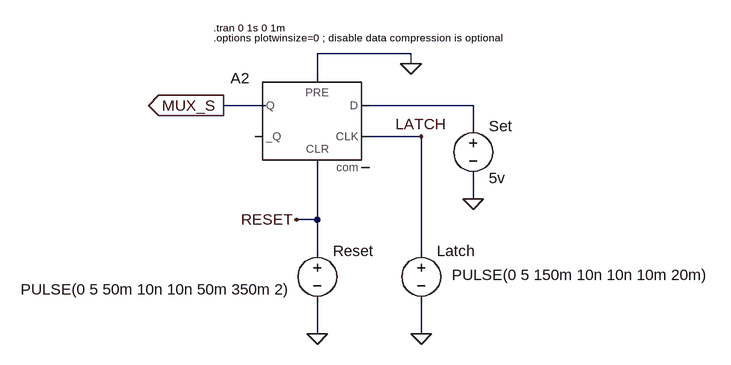
[diagram p0: schematic Flash startup.asc]
Flash startup.asc, the LTspice schematic file:
Version 4
SHEET 1 1752 1128
WIRE -608 112 -752 112
WIRE -608 128 -608 112
WIRE -752 144 -752 112
WIRE -832 192 -896 192
WIRE -512 192 -672 192
WIRE -512 224 -512 192
WIRE -592 240 -672 240
WIRE -512 336 -512 304
WIRE -752 368 -752 288
WIRE -752 368 -784 368
WIRE -752 416 -752 368
WIRE -592 416 -592 240
WIRE -752 544 -752 496
WIRE -592 544 -592 496
FLAG -752 544 0
FLAG -896 192 MUX_S
IOPIN -896 192 Out
FLAG -592 544 0
FLAG -512 336 0
FLAG -608 128 0
FLAG -784 368 RESET
FLAG -592 240 LATCH
SYMBOL voltage -752 400 R0
WINDOW 123 0 0 Left 2
WINDOW 39 0 0 Left 2
WINDOW 3 -38 75 Right 2
SYMATTR Value PULSE(0 5 50m 10n 10n 50m 350m 2)
SYMATTR InstName Reset
SYMBOL Digital\\dflop -752 144 M0
SYMATTR InstName A2
SYMATTR SpiceLine vhigh=5 vlow=0 td=10n trise=5n
SYMBOL voltage -592 400 R0
WINDOW 123 0 0 Left 2
WINDOW 39 0 0 Left 2
WINDOW 3 47 53 Left 2
SYMATTR Value PULSE(0 5 150m 10n 10n 10m 20m)
SYMATTR InstName Latch
SYMBOL voltage -512 208 R0
WINDOW 123 0 0 Left 2
WINDOW 39 0 0 Left 2
SYMATTR InstName Set
SYMATTR Value 5v
TEXT -912 72 Left 1 !.tran 0 1s 0 1m
TEXT -912 88 Left 1 !.options plotwinsize=0 ; disable data compression is optional

The netlist it stands for:
* Flash startup.asc
V§Reset RESET 0 PULSE(0 5 50m 10n 10n 50m 350m 2)
A2 N001 0 LATCH 0 RESET 0 MUX_S 0 DFLOP vhigh=5 vlow=0 td=10n trise=5n
V§Latch LATCH 0 PULSE(0 5 150m 10n 10n 10m 20m)
V§Set N001 0 5v
.tran 0 1s 0 1m
.options plotwinsize=0 ; disable data compression is optional
.backanno
.end

* Results of the author's LTspice run, read from the files saved beside the schematic
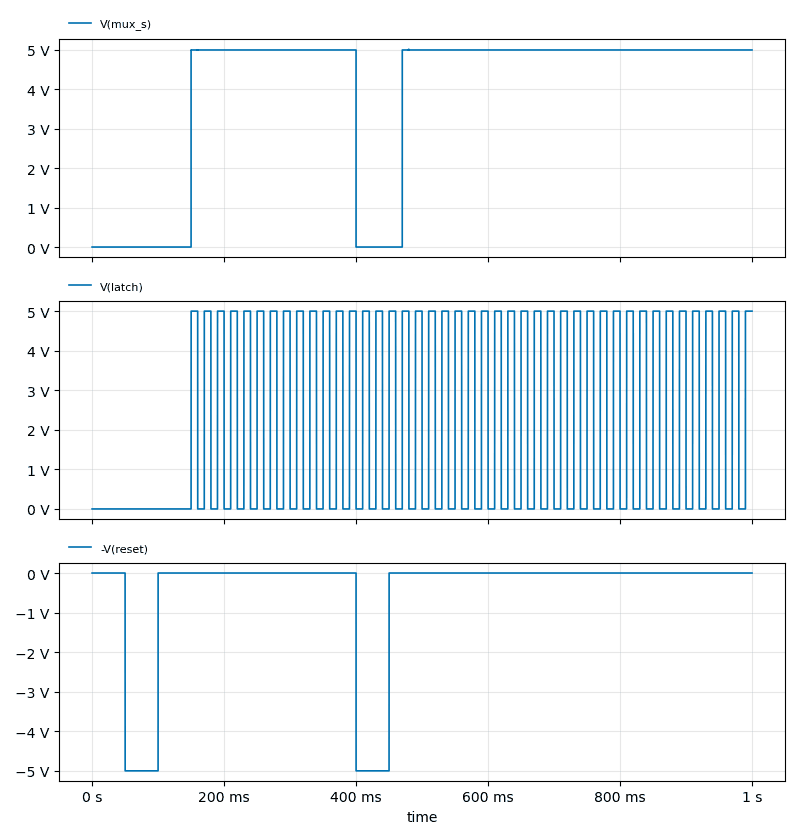
[diagram p1: Transient Analysis of Flash startup.asc, plotted from the saved traces]
* Transient Analysis, 1 run:
*   V(mux_s): min -450.4 µV, max 5.018 V, average 3.9 V, rms 4.416 V, last 5 V
*   V(latch): min 0 V, max 5 V, average 2.15 V, rms 3.279 V, last 5 V
*   -V(reset): min -5 V, max 0 V, average -500 mV, rms 1.581 V, last 0 V